# EasyEDA Pro project 60%.eprj

# Schematic 60%
Board Name: 60%; Create Date: 2025-09-20; Page Name: 60%; Project Name: 60%; Schematic Name: 60%; Update Date: 2025-09-21; File: 60%; Id: /; Sheet: /
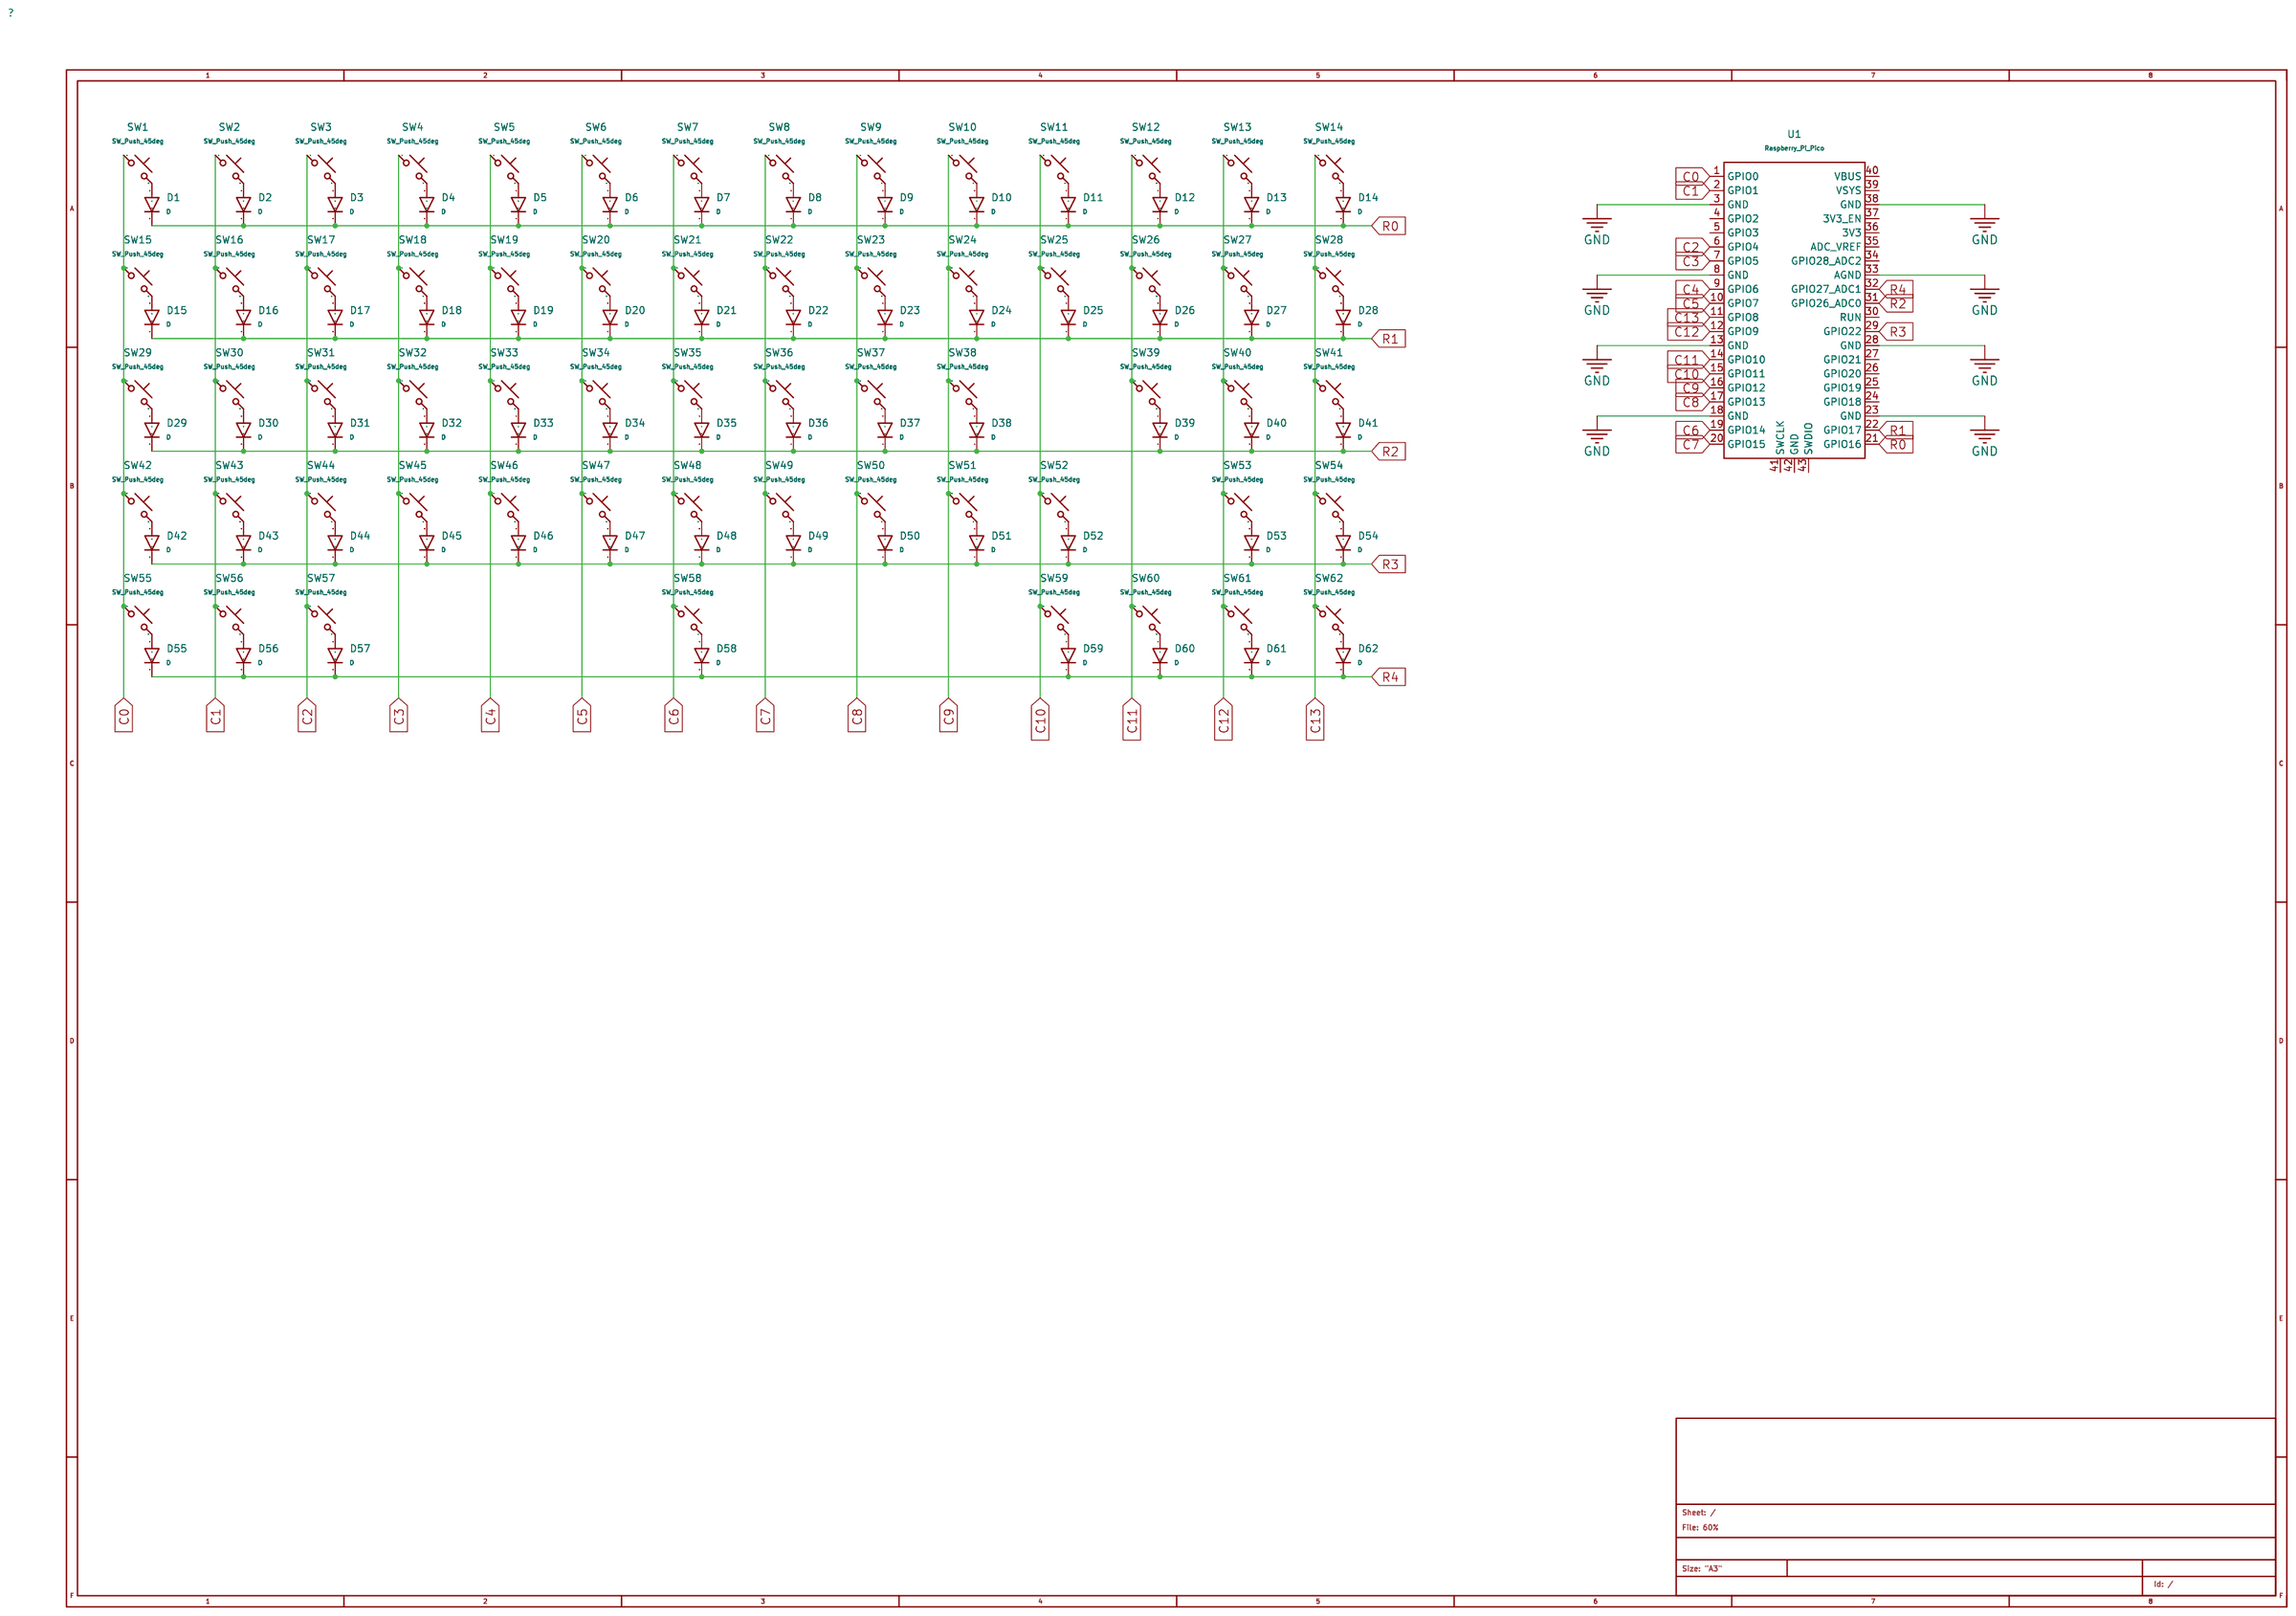
[diagram p0: schematic sheet]

## Parts
D1  D  [Diode_DO-35]
D2  D  [Diode_DO-35]
D3  D  [Diode_DO-35]
D4  D  [Diode_DO-35]
D5  D  [Diode_DO-35]
D6  D  [Diode_DO-35]
D7  D  [Diode_DO-35]
D8  D  [Diode_DO-35]
D9  D  [Diode_DO-35]
D10  D  [Diode_DO-35]
D11  D  [Diode_DO-35]
D12  D  [Diode_DO-35]
D13  D  [Diode_DO-35]
D14  D  [Diode_DO-35]
D15  D  [Diode_DO-35]
D16  D  [Diode_DO-35]
D17  D  [Diode_DO-35]
D18  D  [Diode_DO-35]
D19  D  [Diode_DO-35]
D20  D  [Diode_DO-35]
D21  D  [Diode_DO-35]
D22  D  [Diode_DO-35]
D23  D  [Diode_DO-35]
D24  D  [Diode_DO-35]
D25  D  [Diode_DO-35]
D26  D  [Diode_DO-35]
D27  D  [Diode_DO-35]
D28  D  [Diode_DO-35]
D29  D  [Diode_DO-35]
D30  D  [Diode_DO-35]
D31  D  [Diode_DO-35]
D32  D  [Diode_DO-35]
D33  D  [Diode_DO-35]
D34  D  [Diode_DO-35]
D35  D  [Diode_DO-35]
D36  D  [Diode_DO-35]
D37  D  [Diode_DO-35]
D38  D  [Diode_DO-35]
D39  D  [Diode_DO-35]
D40  D  [Diode_DO-35]
D41  D  [Diode_DO-35]
D42  D  [Diode_DO-35]
D43  D  [Diode_DO-35]
D44  D  [Diode_DO-35]
D45  D  [Diode_DO-35]
D46  D  [Diode_DO-35]
D47  D  [Diode_DO-35]
D48  D  [Diode_DO-35]
D49  D  [Diode_DO-35]
D50  D  [Diode_DO-35]
D51  D  [Diode_DO-35]
D52  D  [Diode_DO-35]
D53  D  [Diode_DO-35]
D54  D  [Diode_DO-35]
D55  D  [Diode_DO-35]
D56  D  [Diode_DO-35]
D57  D  [Diode_DO-35]
D58  D  [Diode_DO-35]
D59  D  [Diode_DO-35]
D60  D  [Diode_DO-35]
D61  D  [Diode_DO-35]
D62  D  [Diode_DO-35]
SW1  SW_Push_45deg  [MX_PCB_1.00u]
SW2  SW_Push_45deg  [MX_PCB_1.00u]
SW3  SW_Push_45deg  [MX_PCB_1.00u]
SW4  SW_Push_45deg  [MX_PCB_1.00u]
SW5  SW_Push_45deg  [MX_PCB_1.00u]
SW6  SW_Push_45deg  [MX_PCB_1.00u]
SW7  SW_Push_45deg  [MX_PCB_1.00u]
SW8  SW_Push_45deg  [MX_PCB_1.00u]
SW9  SW_Push_45deg  [MX_PCB_1.00u]
SW10  SW_Push_45deg  [MX_PCB_1.00u]
SW11  SW_Push_45deg  [MX_PCB_1.00u]
SW12  SW_Push_45deg  [MX_PCB_1.00u]
SW13  SW_Push_45deg  [MX_PCB_1.00u]
SW14  SW_Push_45deg  [MX_PCB_2.00u]
SW15  SW_Push_45deg  [MX_PCB_1.50u]
SW16  SW_Push_45deg  [MX_PCB_1.00u]
SW17  SW_Push_45deg  [MX_PCB_1.00u]
SW18  SW_Push_45deg  [MX_PCB_1.00u]
SW19  SW_Push_45deg  [MX_PCB_1.00u]
SW20  SW_Push_45deg  [MX_PCB_1.00u]
SW21  SW_Push_45deg  [MX_PCB_1.00u]
SW22  SW_Push_45deg  [MX_PCB_1.00u]
SW23  SW_Push_45deg  [MX_PCB_1.00u]
SW24  SW_Push_45deg  [MX_PCB_1.00u]
SW25  SW_Push_45deg  [MX_PCB_1.00u]
SW26  SW_Push_45deg  [MX_PCB_1.00u]
SW27  SW_Push_45deg  [MX_PCB_1.00u]
SW28  SW_Push_45deg  [MX_PCB_1.50u]
SW29  SW_Push_45deg  [MX_PCB_1.75u]
SW30  SW_Push_45deg  [MX_PCB_1.00u]
SW31  SW_Push_45deg  [MX_PCB_1.00u]
SW32  SW_Push_45deg  [MX_PCB_1.00u]
SW33  SW_Push_45deg  [MX_PCB_1.00u]
SW34  SW_Push_45deg  [MX_PCB_1.00u]
SW35  SW_Push_45deg  [MX_PCB_1.00u]
SW36  SW_Push_45deg  [MX_PCB_1.00u]
SW37  SW_Push_45deg  [MX_PCB_1.00u]
SW38  SW_Push_45deg  [MX_PCB_1.00u]
SW39  SW_Push_45deg  [MX_PCB_1.00u]
SW40  SW_Push_45deg  [MX_PCB_1.00u]
SW41  SW_Push_45deg  [MX_PCB_2.25u]
SW42  SW_Push_45deg  [MX_PCB_2.00u]
SW43  SW_Push_45deg  [MX_PCB_1.00u]
SW44  SW_Push_45deg  [MX_PCB_1.00u]
SW45  SW_Push_45deg  [MX_PCB_1.00u]
SW46  SW_Push_45deg  [MX_PCB_1.00u]
SW47  SW_Push_45deg  [MX_PCB_1.00u]
SW48  SW_Push_45deg  [MX_PCB_1.00u]
SW49  SW_Push_45deg  [MX_PCB_1.00u]
SW50  SW_Push_45deg  [MX_PCB_1.00u]
SW51  SW_Push_45deg  [MX_PCB_1.00u]
SW52  SW_Push_45deg  [MX_PCB_1.00u]
SW53  SW_Push_45deg  [MX_PCB_1.00u]
SW54  SW_Push_45deg  [MX_PCB_2.00u]
SW55  SW_Push_45deg  [MX_PCB_1.25u]
SW56  SW_Push_45deg  [MX_PCB_1.25u]
SW57  SW_Push_45deg  [MX_PCB_1.25u]
SW58  SW_Push_45deg  [MX_Plate_6.25u]
SW59  SW_Push_45deg  [MX_PCB_1.25u]
SW60  SW_Push_45deg  [MX_PCB_1.25u]
SW61  SW_Push_45deg  [MX_PCB_1.25u]
SW62  SW_Push_45deg  [MX_PCB_1.25u]
U1  Raspberry_Pi_Pico  [Raspberry_Pi_Pico]

## Library data of the parts
D1-D62 = Device_D: Diode; Sim_Pins: 1=K 2=A; Sim.Pins: 1=K 2=A
SW1-SW62 = Switch_SW_Push_45deg: Push button switch, normally open, two pins, 45° tilted
U1 = ScottoKeebs_MCU_Raspberry_Pi_Pico

## Nets
GND: U1.3(GND) U1.8(GND) U1.13(GND) U1.18(GND) U1.23(GND) U1.28(GND) U1.33(AGND) U1.38(GND)
C0: SW1.1 SW15.1 SW29.1 SW42.1 SW55.1 U1.1(GPIO0)
C1: SW2.1 SW16.1 SW30.1 SW43.1 SW56.1 U1.2(GPIO1)
C2: SW3.1 SW17.1 SW31.1 SW44.1 SW57.1 U1.6(GPIO4)
C3: SW4.1 SW18.1 SW32.1 SW45.1 U1.7(GPIO5)
C4: SW5.1 SW19.1 SW33.1 SW46.1 U1.9(GPIO6)
C5: SW6.1 SW20.1 SW34.1 SW47.1 U1.10(GPIO7)
C6: SW7.1 SW21.1 SW35.1 SW48.1 SW58.1 U1.19(GPIO14)
C7: SW8.1 SW22.1 SW36.1 SW49.1 U1.20(GPIO15)
C8: SW9.1 SW23.1 SW37.1 SW50.1 U1.17(GPIO13)
C9: SW10.1 SW24.1 SW38.1 SW51.1 U1.16(GPIO12)
C10: SW11.1 SW25.1 SW52.1 SW59.1 U1.15(GPIO11)
C11: SW12.1 SW26.1 SW39.1 SW60.1 U1.14(GPIO10)
C12: SW13.1 SW27.1 SW40.1 SW53.1 SW61.1 U1.12(GPIO9)
C13: SW14.1 SW28.1 SW41.1 SW54.1 SW62.1 U1.11(GPIO8)
R0: D1.1(K) D2.1(K) D3.1(K) D4.1(K) D5.1(K) D6.1(K) D7.1(K) D8.1(K) D9.1(K) D10.1(K) D11.1(K) D12.1(K) D13.1(K) D14.1(K) U1.21(GPIO16)
R1: D15.1(K) D16.1(K) D17.1(K) D18.1(K) D19.1(K) D20.1(K) D21.1(K) D22.1(K) D23.1(K) D24.1(K) D25.1(K) D26.1(K) D27.1(K) D28.1(K) U1.22(GPIO17)
R2: D29.1(K) D30.1(K) D31.1(K) D32.1(K) D33.1(K) D34.1(K) D35.1(K) D36.1(K) D37.1(K) D38.1(K) D39.1(K) D40.1(K) D41.1(K) U1.31(GPIO26_ADC0)
R3: D42.1(K) D43.1(K) D44.1(K) D45.1(K) D46.1(K) D47.1(K) D48.1(K) D49.1(K) D50.1(K) D51.1(K) D52.1(K) D53.1(K) D54.1(K) U1.29(GPIO22)
R4: D55.1(K) D56.1(K) D57.1(K) D58.1(K) D59.1(K) D60.1(K) D61.1(K) D62.1(K) U1.32(GPIO27_ADC1)
$1N1580: D43.2(A) SW43.2
$1N1581: D16.2(A) SW16.2
$1N1582: D56.2(A) SW56.2
$1N1583: D49.2(A) SW49.2
$1N1584: D4.2(A) SW4.2
$1N1585: D26.2(A) SW26.2
$1N1586: D27.2(A) SW27.2
$1N1587: D19.2(A) SW19.2
$1N1588: D20.2(A) SW20.2
$1N1589: D36.2(A) SW36.2
$1N1590: D59.2(A) SW59.2
$1N1591: D30.2(A) SW30.2
$1N1592: D45.2(A) SW45.2
$1N1593: D44.2(A) SW44.2
$1N1594: D6.2(A) SW6.2
$1N1595: D8.2(A) SW8.2
$1N1596: D10.2(A) SW10.2
$1N1597: D37.2(A) SW37.2
$1N1598: D29.2(A) SW29.2
$1N1599: D22.2(A) SW22.2
$1N1600: D32.2(A) SW32.2
$1N1601: D3.2(A) SW3.2
$1N1602: D31.2(A) SW31.2
$1N1603: D46.2(A) SW46.2
$1N1604: D57.2(A) SW57.2
$1N1605: D47.2(A) SW47.2
$1N1606: D24.2(A) SW24.2
$1N1607: D35.2(A) SW35.2
$1N1608: D21.2(A) SW21.2
$1N1609: D52.2(A) SW52.2
$1N1610: D17.2(A) SW17.2
$1N1611: D28.2(A) SW28.2
$1N1612: D51.2(A) SW51.2
$1N1613: D40.2(A) SW40.2
$1N1614: D33.2(A) SW33.2
$1N1615: D34.2(A) SW34.2
$1N1616: D50.2(A) SW50.2
$1N1617: D55.2(A) SW55.2
$1N1618: D62.2(A) SW62.2
$1N1619: D41.2(A) SW41.2
$1N1620: D25.2(A) SW25.2
$1N1621: D2.2(A) SW2.2
$1N1622: D58.2(A) SW58.2
$1N1623: D23.2(A) SW23.2
$1N1624: D61.2(A) SW61.2
$1N1625: D18.2(A) SW18.2
$1N1626: D42.2(A) SW42.2
$1N1627: D15.2(A) SW15.2
$1N1628: D12.2(A) SW12.2
$1N1629: D7.2(A) SW7.2
$1N1630: D1.2(A) SW1.2
$1N1631: D13.2(A) SW13.2
$1N1632: D53.2(A) SW53.2
$1N1633: D14.2(A) SW14.2
$1N1634: D38.2(A) SW38.2
$1N1635: D54.2(A) SW54.2
$1N1636: D60.2(A) SW60.2
$1N1637: D39.2(A) SW39.2
$1N1638: D11.2(A) SW11.2
$1N1639: D5.2(A) SW5.2
$1N1640: D48.2(A) SW48.2
$1N1641: D9.2(A) SW9.2

Not connected (* = marked no-connect by the designer): U1 4(GPIO2) 5(GPIO3) 24(GPIO18) 25(GPIO19) 26(GPIO20) 27(GPIO21) 30(RUN) 34(GPIO28_ADC2) 35(ADC_VREF) 36(3V3) 37(3V3_EN) 39(VSYS) 40(VBUS) 41(SWCLK) 42(GND) 43(SWDIO)

# Board 60%
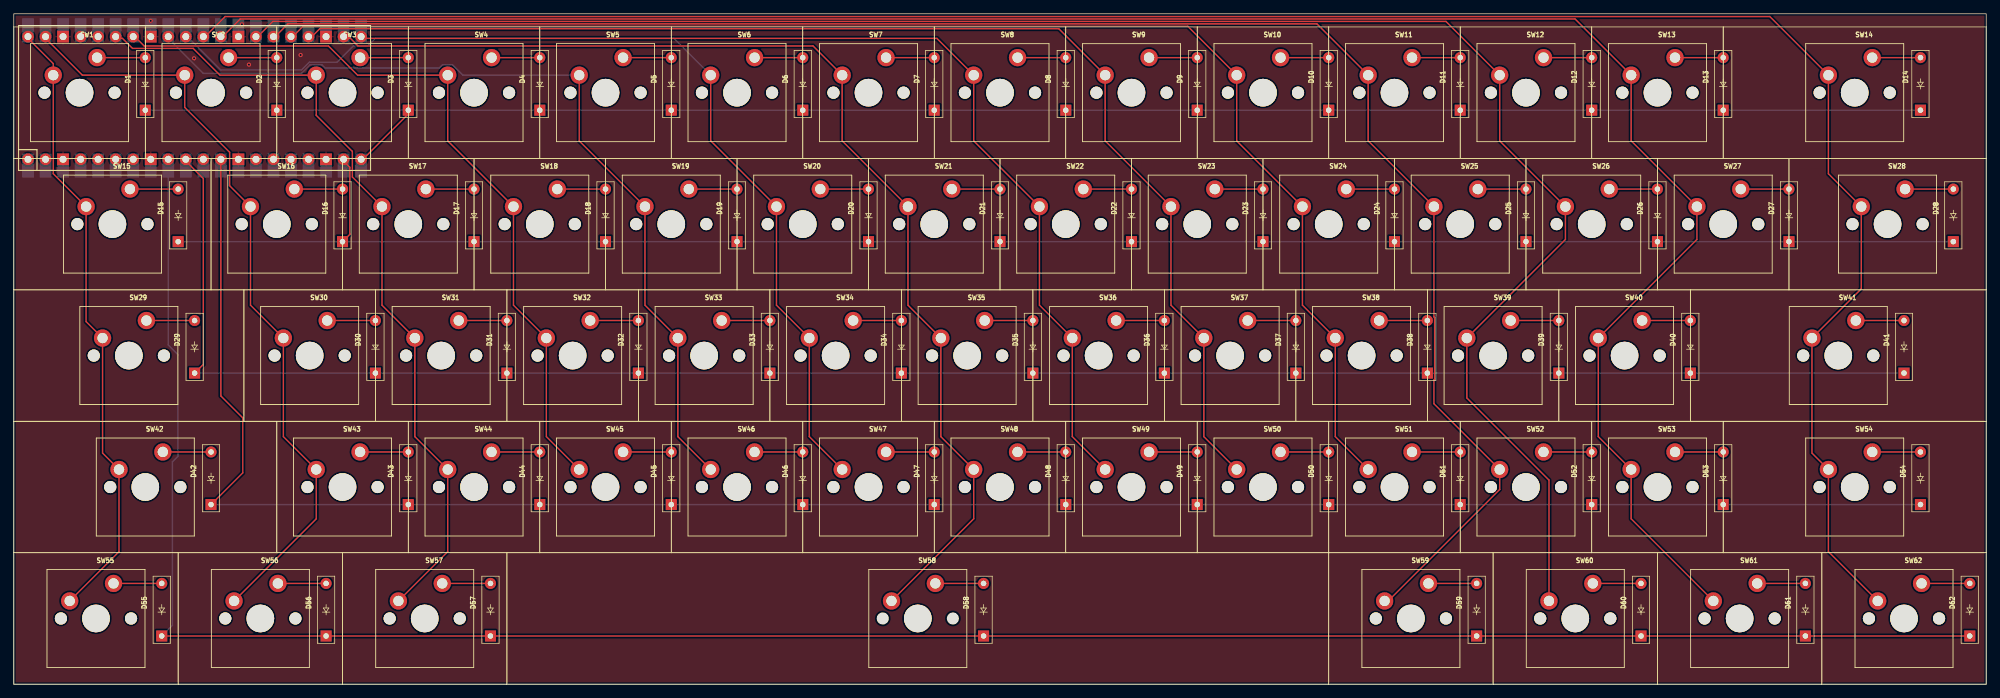
[diagram p1: board, top side]
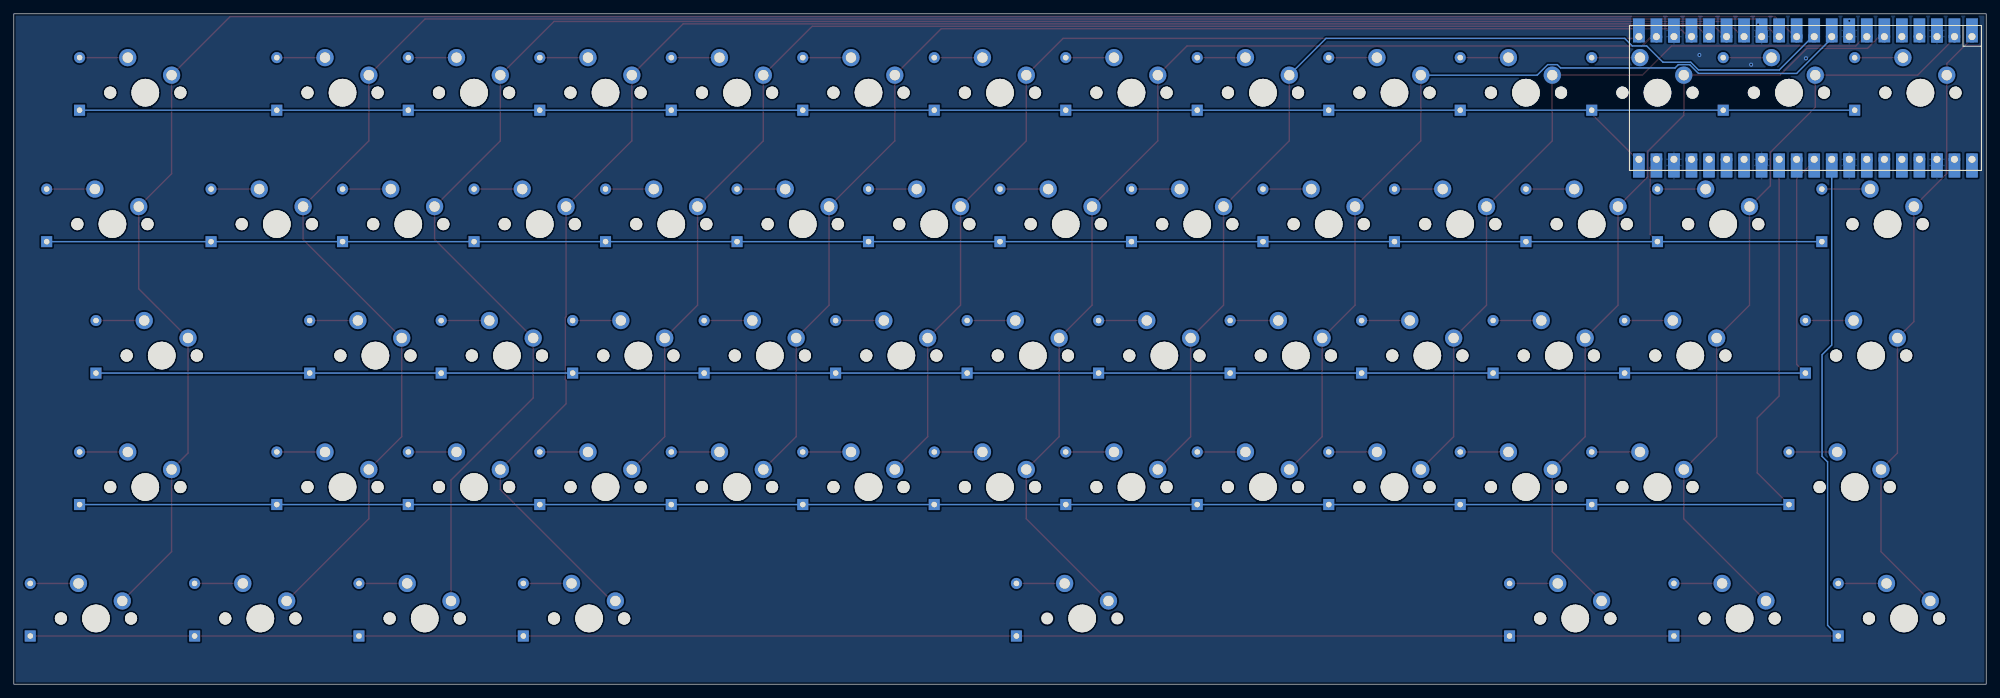
[diagram p2: board, bottom side, seen from below]

Outline 285.75 x 97.16 mm; copper layers: Top Layer, Bottom Layer. Coordinates in mm from the lower left corner of the outline.
Outline path: rectangle 0,97.16 285.75,0
Stack: Top Layer 0.035mm / Dielectric1 1.51mm FR4 er 4.5 / Bottom Layer 0.035mm

## Design rules (mm)
spacing safeClearance (default): track to track 0.152, other pairs 0.152 to 0.3
track width trackWidth (default): min 0.127, default 0.254, max 2.54
differential pair differentialPair (default): width min 0.127, default 0.254, max 2.54; gap min 0.152, default 0.152
via viaSize (default): diameter min 0.5, default 0.61, max 10; hole min 0.3, default 0.305, max 6

## Placement (name value [footprint] x y rotation side)
D1  D  [Diode_DO-35]  19.05 83.18 90 top
D2  D  [Diode_DO-35]  38.1 83.18 90 top
D3  D  [Diode_DO-35]  57.15 83.18 90 top
D4  D  [Diode_DO-35]  76.2 83.18 90 top
D5  D  [Diode_DO-35]  95.25 83.18 90 top
D6  D  [Diode_DO-35]  114.3 83.18 90 top
D7  D  [Diode_DO-35]  133.35 83.18 90 top
D8  D  [Diode_DO-35]  152.4 83.18 90 top
D9  D  [Diode_DO-35]  171.45 83.18 90 top
D10  D  [Diode_DO-35]  190.5 83.18 90 top
D11  D  [Diode_DO-35]  209.55 83.18 90 top
D12  D  [Diode_DO-35]  228.6 83.18 90 top
D13  D  [Diode_DO-35]  247.65 83.18 90 top
D14  D  [Diode_DO-35]  276.22 83.18 90 top
D15  D  [Diode_DO-35]  23.81 64.13 90 top
D16  D  [Diode_DO-35]  47.62 64.13 90 top
D17  D  [Diode_DO-35]  66.68 64.13 90 top
D18  D  [Diode_DO-35]  85.73 64.13 90 top
D19  D  [Diode_DO-35]  104.78 64.13 90 top
D20  D  [Diode_DO-35]  123.83 64.13 90 top
D21  D  [Diode_DO-35]  142.88 64.13 90 top
D22  D  [Diode_DO-35]  161.92 64.13 90 top
D23  D  [Diode_DO-35]  180.97 64.13 90 top
D24  D  [Diode_DO-35]  200.03 64.13 90 top
D25  D  [Diode_DO-35]  219.07 64.13 90 top
D26  D  [Diode_DO-35]  238.12 64.13 90 top
D27  D  [Diode_DO-35]  257.18 64.13 90 top
D28  D  [Diode_DO-35]  280.99 64.13 90 top
D29  D  [Diode_DO-35]  26.19 45.08 90 top
D30  D  [Diode_DO-35]  52.39 45.08 90 top
D31  D  [Diode_DO-35]  71.44 45.08 90 top
D32  D  [Diode_DO-35]  90.49 45.08 90 top
D33  D  [Diode_DO-35]  109.54 45.08 90 top
D34  D  [Diode_DO-35]  128.59 45.08 90 top
D35  D  [Diode_DO-35]  147.64 45.08 90 top
D36  D  [Diode_DO-35]  166.69 45.08 90 top
D37  D  [Diode_DO-35]  185.74 45.08 90 top
D38  D  [Diode_DO-35]  204.79 45.08 90 top
D39  D  [Diode_DO-35]  223.84 45.08 90 top
D40  D  [Diode_DO-35]  242.89 45.08 90 top
D41  D  [Diode_DO-35]  273.84 45.08 90 top
D42  D  [Diode_DO-35]  28.57 26.03 90 top
D43  D  [Diode_DO-35]  57.15 26.03 90 top
D44  D  [Diode_DO-35]  76.2 26.03 90 top
D45  D  [Diode_DO-35]  95.25 26.03 90 top
D46  D  [Diode_DO-35]  114.3 26.03 90 top
D47  D  [Diode_DO-35]  133.35 26.03 90 top
D48  D  [Diode_DO-35]  152.4 26.03 90 top
D49  D  [Diode_DO-35]  171.45 26.03 90 top
D50  D  [Diode_DO-35]  190.5 26.03 90 top
D51  D  [Diode_DO-35]  209.55 26.03 90 top
D52  D  [Diode_DO-35]  228.6 26.03 90 top
D53  D  [Diode_DO-35]  247.65 26.03 90 top
D54  D  [Diode_DO-35]  276.22 26.03 90 top
D55  D  [Diode_DO-35]  21.43 6.98 90 top
D56  D  [Diode_DO-35]  45.24 6.98 90 top
D57  D  [Diode_DO-35]  69.06 6.98 90 top
D58  D  [Diode_DO-35]  140.49 6.98 90 top
D59  D  [Diode_DO-35]  211.93 6.98 90 top
D60  D  [Diode_DO-35]  235.74 6.98 90 top
D61  D  [Diode_DO-35]  259.56 6.98 90 top
D62  D  [Diode_DO-35]  283.37 6.98 90 top
SW1  SW_Push_45deg  [MX_PCB_1.00u]  9.53 85.72 0 top
SW2  SW_Push_45deg  [MX_PCB_1.00u]  28.57 85.72 0 top
SW3  SW_Push_45deg  [MX_PCB_1.00u]  47.62 85.72 0 top
SW4  SW_Push_45deg  [MX_PCB_1.00u]  66.68 85.72 0 top
SW5  SW_Push_45deg  [MX_PCB_1.00u]  85.73 85.72 0 top
SW6  SW_Push_45deg  [MX_PCB_1.00u]  104.78 85.72 0 top
SW7  SW_Push_45deg  [MX_PCB_1.00u]  123.83 85.72 0 top
SW8  SW_Push_45deg  [MX_PCB_1.00u]  142.88 85.72 0 top
SW9  SW_Push_45deg  [MX_PCB_1.00u]  161.92 85.72 0 top
SW10  SW_Push_45deg  [MX_PCB_1.00u]  180.97 85.72 0 top
SW11  SW_Push_45deg  [MX_PCB_1.00u]  200.03 85.72 0 top
SW12  SW_Push_45deg  [MX_PCB_1.00u]  219.07 85.72 0 top
SW13  SW_Push_45deg  [MX_PCB_1.00u]  238.12 85.72 0 top
SW14  SW_Push_45deg  [MX_PCB_2.00u]  266.7 85.72 0 top
SW15  SW_Push_45deg  [MX_PCB_1.50u]  14.29 66.67 0 top
SW16  SW_Push_45deg  [MX_PCB_1.00u]  38.1 66.67 0 top
SW17  SW_Push_45deg  [MX_PCB_1.00u]  57.15 66.67 0 top
SW18  SW_Push_45deg  [MX_PCB_1.00u]  76.2 66.67 0 top
SW19  SW_Push_45deg  [MX_PCB_1.00u]  95.25 66.67 0 top
SW20  SW_Push_45deg  [MX_PCB_1.00u]  114.3 66.67 0 top
SW21  SW_Push_45deg  [MX_PCB_1.00u]  133.35 66.67 0 top
SW22  SW_Push_45deg  [MX_PCB_1.00u]  152.4 66.67 0 top
SW23  SW_Push_45deg  [MX_PCB_1.00u]  171.45 66.67 0 top
SW24  SW_Push_45deg  [MX_PCB_1.00u]  190.5 66.67 0 top
SW25  SW_Push_45deg  [MX_PCB_1.00u]  209.55 66.67 0 top
SW26  SW_Push_45deg  [MX_PCB_1.00u]  228.6 66.67 0 top
SW27  SW_Push_45deg  [MX_PCB_1.00u]  247.65 66.67 0 top
SW28  SW_Push_45deg  [MX_PCB_1.50u]  271.46 66.67 0 top
SW29  SW_Push_45deg  [MX_PCB_1.75u]  16.67 47.62 0 top
SW30  SW_Push_45deg  [MX_PCB_1.00u]  42.86 47.62 0 top
SW31  SW_Push_45deg  [MX_PCB_1.00u]  61.91 47.62 0 top
SW32  SW_Push_45deg  [MX_PCB_1.00u]  80.96 47.62 0 top
SW33  SW_Push_45deg  [MX_PCB_1.00u]  100.01 47.62 0 top
SW34  SW_Push_45deg  [MX_PCB_1.00u]  119.06 47.62 0 top
SW35  SW_Push_45deg  [MX_PCB_1.00u]  138.11 47.62 0 top
SW36  SW_Push_45deg  [MX_PCB_1.00u]  157.16 47.62 0 top
SW37  SW_Push_45deg  [MX_PCB_1.00u]  176.21 47.62 0 top
SW38  SW_Push_45deg  [MX_PCB_1.00u]  195.26 47.62 0 top
SW39  SW_Push_45deg  [MX_PCB_1.00u]  214.31 47.62 0 top
SW40  SW_Push_45deg  [MX_PCB_1.00u]  233.36 47.62 0 top
SW41  SW_Push_45deg  [MX_PCB_2.25u]  264.32 47.62 0 top
SW42  SW_Push_45deg  [MX_PCB_2.00u]  19.05 28.57 0 top
SW43  SW_Push_45deg  [MX_PCB_1.00u]  47.62 28.57 0 top
SW44  SW_Push_45deg  [MX_PCB_1.00u]  66.68 28.57 0 top
SW45  SW_Push_45deg  [MX_PCB_1.00u]  85.73 28.57 0 top
SW46  SW_Push_45deg  [MX_PCB_1.00u]  104.78 28.57 0 top
SW47  SW_Push_45deg  [MX_PCB_1.00u]  123.83 28.57 0 top
SW48  SW_Push_45deg  [MX_PCB_1.00u]  142.88 28.57 0 top
SW49  SW_Push_45deg  [MX_PCB_1.00u]  161.92 28.57 0 top
SW50  SW_Push_45deg  [MX_PCB_1.00u]  180.97 28.57 0 top
SW51  SW_Push_45deg  [MX_PCB_1.00u]  200.03 28.57 0 top
SW52  SW_Push_45deg  [MX_PCB_1.00u]  219.07 28.57 0 top
SW53  SW_Push_45deg  [MX_PCB_1.00u]  238.12 28.57 0 top
SW54  SW_Push_45deg  [MX_PCB_2.00u]  266.7 28.57 0 top
SW55  SW_Push_45deg  [MX_PCB_1.25u]  11.91 9.53 0 top
SW56  SW_Push_45deg  [MX_PCB_1.25u]  35.72 9.53 0 top
SW57  SW_Push_45deg  [MX_PCB_1.25u]  59.53 9.53 0 top
SW58  SW_Push_45deg  [MX_Plate_6.25u]  130.97 9.53 0 top
SW59  SW_Push_45deg  [MX_PCB_1.25u]  202.41 9.53 0 top
SW60  SW_Push_45deg  [MX_PCB_1.25u]  226.22 9.53 0 top
SW61  SW_Push_45deg  [MX_PCB_1.25u]  250.03 9.53 0 top
SW62  SW_Push_45deg  [MX_PCB_1.25u]  273.84 9.53 0 top
U1  -  [Raspberry_Pi_Pico]  26.19 84.96 270 bottom

## Footprints (pads in the part's own frame, mm; a bottom-side part is the same pattern mirrored in y, then rotated)
Diode_DO-35
  rect 1.6x1.6 hole 0.8: 1(0,0)
  round 1.6 hole 0.8: 2(7.62,0)
MX_PCB_1.00u
  round 1.75 hole 1.75: (-5.08,0) (5.08,0)
  round 4 hole 4: (0,0)
  round 2.5 hole 1.5: 1(-3.81,2.54) 2(2.54,5.08)
MX_PCB_1.25u
  round 1.75 hole 1.75: (-5.08,0) (5.08,0)
  round 4 hole 4: (0,0)
  round 2.5 hole 1.5: 1(-3.81,2.54) 2(2.54,5.08)
MX_PCB_1.50u
  round 1.75 hole 1.75: (-5.08,0) (5.08,0)
  round 4 hole 4: (0,0)
  round 2.5 hole 1.5: 1(-3.81,2.54) 2(2.54,5.08)
MX_PCB_1.75u
  round 1.75 hole 1.75: (-5.08,0) (5.08,0)
  round 4 hole 4: (0,0)
  round 2.5 hole 1.5: 1(-3.81,2.54) 2(2.54,5.08)
MX_PCB_2.00u
  round 1.75 hole 1.75: (-5.08,0) (5.08,0)
  round 4 hole 4: (0,0)
  round 2.5 hole 1.5: 1(-3.81,2.54) 2(2.54,5.08)
MX_PCB_2.25u
  round 1.75 hole 1.75: (-5.08,0) (5.08,0)
  round 4 hole 4: (0,0)
  round 2.5 hole 1.5: 1(-3.81,2.54) 2(2.54,5.08)
MX_Plate_6.25u
  round 4 hole 4: (0,0)
  round 2.5 hole 1.5: 1(-3.81,2.54) 2(2.54,5.08)
Raspberry_Pi_Pico
  rect 3.5x1.7 smd: 1(-9.79,24.13) 2(-9.79,21.59) 3(-9.79,19.05) 4(-9.79,16.51) 5(-9.79,13.97) 6(-9.79,11.43) 7(-9.79,8.89) 8(-9.79,6.35) 9(-9.79,3.81) 10(-9.79,1.27) 11(-9.79,-1.27) 12(-9.79,-3.81) 13(-9.79,-6.35) 14(-9.79,-8.89) 15(-9.79,-11.43) 16(-9.79,-13.97) 17(-9.79,-16.51) 18(-9.79,-19.05) 19(-9.79,-21.59) 20(-9.79,-24.13) 21(9.79,-24.13) 22(9.79,-21.59) 23(9.79,-19.05) 24(9.79,-16.51) 25(9.79,-13.97) 26(9.79,-11.43) 27(9.79,-8.89) 28(9.79,-6.35) 29(9.79,-3.81) 30(9.79,-1.27) 31(9.79,1.27) 32(9.79,3.81) 33(9.79,6.35) 34(9.79,8.89) 35(9.79,11.43) 36(9.79,13.97) 37(9.79,16.51) 38(9.79,19.05) 39(9.79,21.59) 40(9.79,24.13)
  round 1.7 hole 1.02: 1(-8.89,24.13) 2(-8.89,21.59) 4(-8.89,16.51) 5(-8.89,13.97) 6(-8.89,11.43) 7(-8.89,8.89) 9(-8.89,3.81) 10(-8.89,1.27) 11(-8.89,-1.27) 12(-8.89,-3.81) 14(-8.89,-8.89) 15(-8.89,-11.43) 16(-8.89,-13.97) 17(-8.89,-16.51) 19(-8.89,-21.59) 20(-8.89,-24.13) 21(8.89,-24.13) 22(8.89,-21.59) 24(8.89,-16.51) 25(8.89,-13.97) 26(8.89,-11.43) 27(8.89,-8.89) 29(8.89,-3.81) 30(8.89,-1.27) 31(8.89,1.27) 32(8.89,3.81) 34(8.89,8.89) 35(8.89,11.43) 36(8.89,13.97) 37(8.89,16.51) 39(8.89,21.59) 40(8.89,24.13)
  rect 1.7x1.7 hole 1.02: 3(-8.89,19.05) 8(-8.89,6.35) 13(-8.89,-6.35) 18(-8.89,-19.05) 23(8.89,-19.05) 28(8.89,-6.35) 33(8.89,6.35) 38(8.89,19.05)

## Nets
As in the schematic.

Pads without a net: U1 4 5 24 25 26 27 30 34 35 36 37 39 40

## Via types
v1: diameter 0.61, hole 0.305, Top Layer to Bottom Layer, 5 vias

## Routing (per net, layer and track width the routed paths; a pad name or vN(x,y) marks a point on that pad's centre or on a via; arc(x,y) is an arc through that point)
GND:
  vias: v1(19.84,96.14) v1(26.12,90.71) v1(33.05,95.63) v1(34.06,89.79) v1(41.55,91.18)
C0: length 90
  Top Layer w0.2: SW55.1 15.24,19.21 SW42.1 12.86,33.5 SW29.1 10.48,52.55 SW15.1 5.71,73.98 5.71,89.94 2.06,93.6
C1: length 111.4
  Top Layer w0.2: 4.6,93.6 9.93,88.26 SW2.1 24.77,83.59 31.27,77.09 31.27,72.24 SW16.1 34.29,54.93 SW30.1 39.05,35.88 SW43.1 43.81,23.97 SW56.1
C2: length 118.3
  Top Layer w0.2: SW57.1 62.87,19.21 SW44.1 58.1,35.88 SW31.1 53.34,54.93 SW17.1 49.05,73.51 49.05,77.21 43.81,82.45 SW3.1 43.81,88.26 29.87,88.26 25.99,92.14 17.19,92.14 15.74,93.6 14.76,93.6
C3: length 112.8
  Top Layer w0.2: 17.3,93.6 17.78,93.6 18.88,92.49 45.58,92.49 49.81,88.26 SW4.1 62.87,78.74 SW18.1 72.39,54.93 SW32.1 77.15,35.88 SW45.1
C4: length 128.2
  Top Layer w0.2: SW46.1 96.2,35.88 SW33.1 91.44,54.93 SW19.1 81.92,78.74 SW5.1
  Bottom Layer w0.2: SW5.1 65.05,88.26 63.53,89.79 62.13,89.79 61.65,89.3 45.09,89.3 44.6,89.79 42.95,89.79 41.68,88.52 27.46,88.52 22.38,93.6
C5: length 147.1
  Top Layer w0.2: SW6.1 100.97,78.74 SW20.1 110.49,54.93 SW34.1 115.25,35.88 SW47.1
  Bottom Layer w0.2: SW6.1 95.63,93.6 52.38,93.6 51.27,92.49 49.19,92.49 46.83,90.14 42.81,90.14 41.69,89.02 29.97,89.02 25.4,93.6 24.92,93.6
C6: length 163.5
  Top Layer w0.2: SW58.1 139.06,23.97 SW48.1 134.3,35.88 SW35.1 129.54,54.93 SW21.1 120.02,78.74 SW7.1 115.79,92.49 49.86,92.49 48.76,93.6 47.78,93.6
C7: length 156
  Top Layer w0.2: 50.32,93.6 133.73,93.6 SW8.1 139.06,78.74 SW22.1 148.59,54.93 SW36.1 153.35,35.88 SW49.1
C8: length 183.8
  Top Layer w0.2: SW50.1 172.4,35.88 SW37.1 167.64,54.93 SW23.1 158.11,78.74 SW9.1 151.39,94.99 44.32,94.99 42.93,93.6 42.7,93.6
C9: length 205.7
  Top Layer w0.2: 40.16,93.6 41.91,95.35 170.08,95.35 SW10.1 177.16,78.74 SW24.1 186.69,54.93 SW38.1 191.45,35.88 SW51.1
C10: length 253.9
  Top Layer w0.2: 37.62,93.6 39.72,95.7 188.78,95.7 SW11.1 196.22,78.74 SW25.1 205.74,53.24 205.84,53.14 205.84,44.18 205.74,44.08 205.74,40.64 SW52.1 215.26,28.22 199.11,12.06 SW59.1
C11: length 275.4
  Top Layer w0.2: 35.08,93.6 37.53,96.05 207.48,96.05 SW12.1 215.26,78.74 SW26.1 224.79,64.45 SW39.1 210.5,41.49 222.41,29.58 SW60.1
C12: length 301.8
  Top Layer w0.2: 30,93.6 32.8,96.4 226.18,96.4 SW13.1 234.31,78.74 SW27.1 243.84,64.45 SW40.1 229.55,35.88 SW53.1 234.31,23.97 SW61.1
C13: length 325.3
  Top Layer w0.2: 27.46,93.6 30.62,96.76 254.4,96.76 SW14.1 262.89,73.98 SW28.1 267.65,57.31 SW41.1 260.51,33.5 SW54.1 262.89,19.21 SW62.1
R0: length 267.4
  Top Layer w0.2: 50.32,75.82 57.15,82.65 D3.1
  Bottom Layer w0.2: D1.1 D2.1 D3.1 D4.1 D5.1 D6.1 D7.1 D8.1 D9.1 D10.1 D11.1 D12.1 D13.1 D14.1
R1: length 269.7
  Top Layer w0.2: 47.78,75.82 48.68,74.92 48.68,65.19 D16.1
  Bottom Layer w0.2: D28.1 D27.1 D26.1 D25.1 D24.1 D23.1 D22.1 D21.1 D20.1 D19.1 D18.1 D17.1 D16.1 D15.1
R2: length 280
  Top Layer w0.2: D29.1 27.46,46.35 27.46,73.28 24.92,75.82
  Bottom Layer w0.2: D41.1 D40.1 D39.1 D38.1 D37.1 D36.1 D35.1 D34.1 D33.1 D32.1 D31.1 D30.1 D29.1
R3: length 300.7
  Top Layer w0.2: D42.1 33.17,30.63 33.17,38.6 30,41.77 30,75.82
  Bottom Layer w0.2: D54.1 D53.1 D52.1 D51.1 D50.1 D49.1 D48.1 D47.1 D46.1 D45.1 D44.1 D43.1 D42.1
R4: length 332.3
  Top Layer w0.2: D55.1 D56.1 D57.1 D58.1 D59.1 D60.1 D61.1 D62.1
  Bottom Layer w0.2: 22.38,75.82 22.38,49.15 23.77,47.75 23.77,33.02 22.98,32.22 22.98,8.53 D55.1
$1N1580: length 7
  Top Layer w0.2: SW43.2 D43.2
$1N1581: length 7
  Top Layer w0.2: SW16.2 D16.2
$1N1582: length 7
  Top Layer w0.2: SW56.2 D56.2
$1N1583: length 7
  Top Layer w0.2: SW49.2 D49.2
$1N1584: length 7
  Top Layer w0.2: SW4.2 D4.2
$1N1585: length 7
  Top Layer w0.2: SW26.2 D26.2
$1N1586: length 7
  Top Layer w0.2: SW27.2 D27.2
$1N1587: length 7
  Top Layer w0.2: SW19.2 D19.2
$1N1588: length 7
  Top Layer w0.2: SW20.2 D20.2
$1N1589: length 7
  Top Layer w0.2: SW36.2 D36.2
$1N1590: length 7
  Top Layer w0.2: SW59.2 D59.2
$1N1591: length 7
  Top Layer w0.2: SW30.2 D30.2
$1N1592: length 7
  Top Layer w0.2: 88.27,33.65 D45.2
$1N1593: length 7
  Top Layer w0.2: SW44.2 D44.2
$1N1594: length 7
  Top Layer w0.2: SW6.2 D6.2
$1N1595: length 7
  Top Layer w0.2: SW8.2 D8.2
$1N1596: length 7
  Top Layer w0.2: SW10.2 D10.2
$1N1597: length 7
  Top Layer w0.2: SW37.2 D37.2
$1N1598: length 7
  Top Layer w0.2: SW29.2 D29.2
$1N1599: length 7
  Top Layer w0.2: SW22.2 D22.2
$1N1600: length 7
  Top Layer w0.2: SW32.2 D32.2
$1N1601: length 7
  Top Layer w0.2: SW3.2 D3.2
$1N1602: length 7
  Top Layer w0.2: SW31.2 D31.2
$1N1603: length 7
  Top Layer w0.2: SW46.2 D46.2
$1N1604: length 7
  Top Layer w0.2: SW57.2 D57.2
$1N1605: length 7
  Top Layer w0.2: SW47.2 D47.2
$1N1606: length 7
  Top Layer w0.2: SW24.2 D24.2
$1N1607: length 7
  Top Layer w0.2: SW35.2 D35.2
$1N1608: length 7
  Top Layer w0.2: SW21.2 D21.2
$1N1609: length 7
  Top Layer w0.2: SW52.2 D52.2
$1N1610: length 7
  Top Layer w0.2: SW17.2 D17.2
$1N1611: length 7
  Top Layer w0.2: SW28.2 D28.2
$1N1612: length 7
  Top Layer w0.2: SW51.2 D51.2
$1N1613: length 7
  Top Layer w0.2: SW40.2 D40.2
$1N1614: length 7
  Top Layer w0.2: SW33.2 D33.2
$1N1615: length 7
  Top Layer w0.2: SW34.2 D34.2
$1N1616: length 7
  Top Layer w0.2: SW50.2 D50.2
$1N1617: length 7
  Top Layer w0.2: SW55.2 D55.2
$1N1618: length 7
  Top Layer w0.2: SW62.2 D62.2
$1N1619: length 7
  Top Layer w0.2: SW41.2 D41.2
$1N1620: length 7
  Top Layer w0.2: SW25.2 D25.2
$1N1621: length 7
  Top Layer w0.2: SW2.2 D2.2
$1N1622: length 7
  Top Layer w0.2: SW58.2 D58.2
$1N1623: length 7
  Top Layer w0.2: SW23.2 D23.2
$1N1624: length 7
  Top Layer w0.2: SW61.2 D61.2
$1N1625: length 7
  Top Layer w0.2: SW18.2 D18.2
$1N1626: length 7
  Top Layer w0.2: SW42.2 D42.2
$1N1627: length 7
  Top Layer w0.2: SW15.2 D15.2
$1N1628: length 7
  Top Layer w0.2: SW12.2 D12.2
$1N1629: length 7
  Top Layer w0.2: SW7.2 D7.2
$1N1630: length 7
  Top Layer w0.2: SW1.2 D1.2
$1N1631: length 7
  Top Layer w0.2: SW13.2 D13.2
$1N1632: length 7
  Top Layer w0.2: SW53.2 D53.2
$1N1633: length 7
  Top Layer w0.2: SW14.2 D14.2
$1N1634: length 7
  Top Layer w0.2: SW38.2 D38.2
$1N1635: length 7
  Top Layer w0.2: SW54.2 D54.2
$1N1636: length 7
  Top Layer w0.2: SW60.2 D60.2
$1N1637: length 7
  Top Layer w0.2: SW39.2 D39.2
$1N1638: length 7
  Top Layer w0.2: SW11.2 D11.2
$1N1639: length 7
  Top Layer w0.2: 88.27,90.8 D5.2
$1N1640: length 7
  Top Layer w0.2: SW48.2 D48.2
$1N1641: length 7
  Top Layer w0.2: SW9.2 D9.2

## Copper pours and planes (outline as drawn; the poured copper is in the pictures)
GND on Top Layer: -5.05,102.74 292.25,102.74 292.25,-10.42 -5.05,-10.42
GND on Bottom Layer: -7.34,105.53 294.54,105.53 294.54,-12.7 -7.34,-12.7
